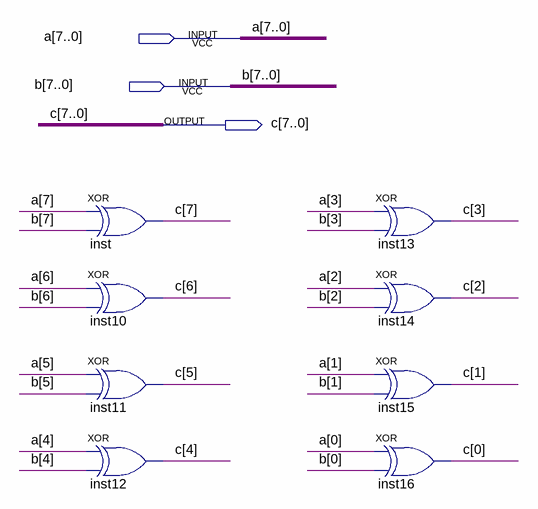
[diagram p0: schematic sheet]
// Quartus schematic xor8bit.bdf as structural Verilog: 8 symbols, 3 pins
module xor8bit (
  input  [7:0] a,
  input  [7:0] b,
  output [7:0] c
);

  xor inst (c[7], a[7], b[7]);
  xor inst10 (c[6], a[6], b[6]);
  xor inst11 (c[5], a[5], b[5]);
  xor inst12 (c[4], a[4], b[4]);
  xor inst13 (c[3], a[3], b[3]);
  xor inst14 (c[2], a[2], b[2]);
  xor inst15 (c[1], a[1], b[1]);
  xor inst16 (c[0], a[0], b[0]);
endmodule
